# Altium schematic sheet driver2.SchDoc
size A4
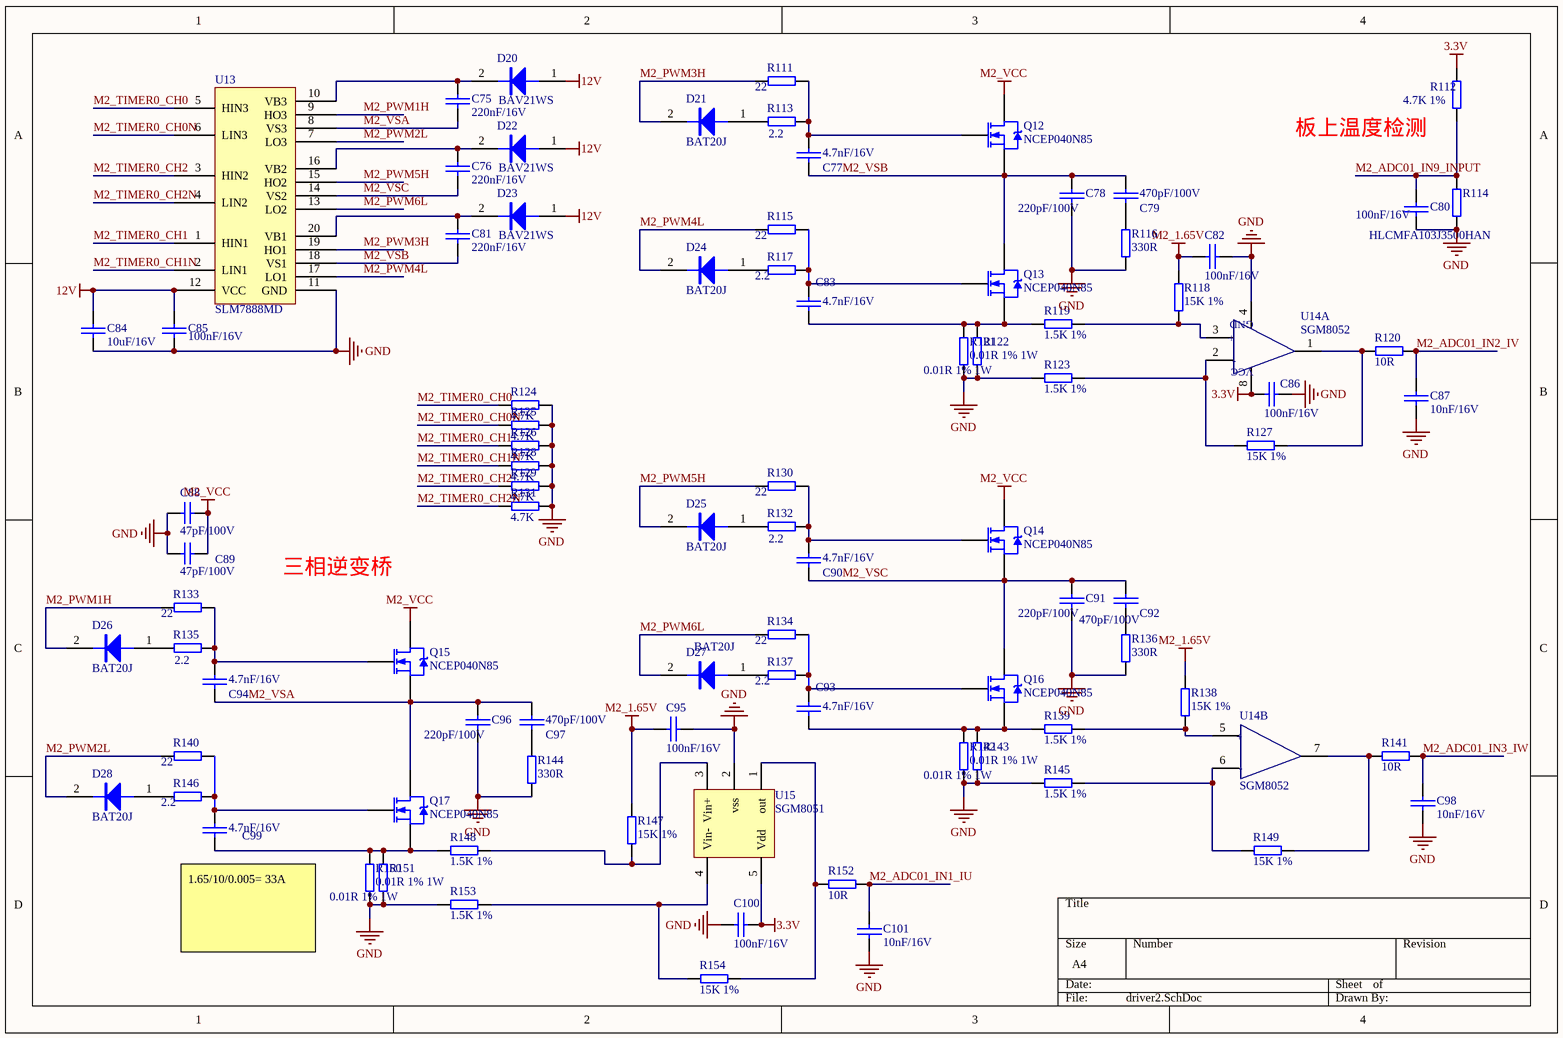
[diagram p0: driver2.SchDoc]

## Parts
C75  220nF/16V  [C0402]
C76  220nF/16V  [C0402]
C77  4.7nF/16V  [C0402]
C78  220pF/100V  [C0805]
C79  470pF/100V  [C0805]
C80  100nF/16V  [C0402]
C81  220nF/16V  [C0402]
C82  100nF/16V  [C0402]
C83  4.7nF/16V  [C0402]
C84  10uF/16V  [C0805]
C85  100nF/16V  [C0603]
C86  100nF/16V  [C0402]
C87  10nF/16V  [C0402]
C88  47pF/100V  [C1206]
C89  47pF/100V  [C1206]
C90  4.7nF/16V  [C0402]
C91  220pF/100V  [C0805]
C92  470pF/100V  [C0805]
C93  4.7nF/16V  [C0402]
C94  4.7nF/16V  [C0402]
C95  100nF/16V  [C0402]
C96  220pF/100V  [C0805]
C97  470pF/100V  [C0805]
C98  10nF/16V  [C0402]
C99  4.7nF/16V  [C0402]
C100  100nF/16V  [C0402]
C101  10nF/16V  [C0402]
D20  BAV21WS  [SOD-323]
D21  BAT20J  [SOD-323]
D22  BAV21WS  [SOD-323]
D23  BAV21WS  [SOD-323]
D24  BAT20J  [SOD-323]
D25  BAT20J  [SOD-323]
D26  BAT20J  [SOD-323]
D27  BAT20J  [SOD-323]
D28  BAT20J  [SOD-323]
Q12  NCEP040N85  [TO-220ABN]
Q13  NCEP040N85  [TO-220ABN]
Q14  NCEP040N85  [TO-220ABN]
Q15  NCEP040N85  [TO-220ABN]
Q16  NCEP040N85  [TO-220ABN]
Q17  NCEP040N85  [TO-220ABN]
R111  22  [R0603]
R112  4.7K 1%  [R0402]
R113  2.2  [R0603]
R114  HLCMFA103J3500HAN  [R0603]
R115  22  [R0603]
R116  330R  [R1206]
R117  2.2  [R0603]
R118  15K 1%  [R0402]
R119  1.5K 1%  [R0402]
R120  10R  [R0402]
R121  0.01R 1% 1W  [R1210]
R122  0.01R 1% 1W  [R1210]
R123  1.5K 1%  [R0402]
R124  4.7K  [R0402]
R125  4.7K  [R0402]
R126  4.7K  [R0402]
R127  15K 1%  [R0402]
R128  4.7K  [R0402]
R129  4.7K  [R0402]
R130  22  [R0603]
R131  4.7K  [R0402]
R132  2.2  [R0603]
R133  22  [R0603]
R134  22  [R0603]
R135  2.2  [R0603]
R136  330R  [R1206]
R137  2.2  [R0603]
R138  15K 1%  [R0402]
R139  1.5K 1%  [R0402]
R140  22  [R0603]
R141  10R  [R0402]
R142  0.01R 1% 1W  [R1210]
R143  0.01R 1% 1W  [R1210]
R144  330R  [R1206]
R145  1.5K 1%  [R0402]
R146  2.2  [R0603]
R147  15K 1%  [R0402]
R148  1.5K 1%  [R0402]
R149  15K 1%  [R0402]
R150  0.01R 1% 1W  [R1210]
R151  0.01R 1% 1W  [R1210]
R152  10R  [R0402]
R153  1.5K 1%  [R0402]
R154  15K 1%  [R0402]
U13  SLM7888MD  [TSSOP-20]
U14  SGM8052  [VSSOP/MSOP-8]  (parts A,B of 2)
U15  SGM8051  [SOT-23(5)]

## Nets
3.3V: C86.2 C100.2 R112.2 U14.8(VCC) U15.5(Vdd)
12V: C84.2 C85.2 D20.1(A) D22.1(A) D23.1(A) U13.12(VCC)
GND: C78.1 C80.2 C82.1 C84.1 C85.1 C86.1 C87.2 C88.2 C89.2 C91.1 C95.1 C96.1 C98.2 C100.1 C101.2 R114.1 R116.1 R121.2 R122.2 R123.2 R124.2 R125.2 R126.2 R128.2 R129.2 R131.2 R136.1 R142.2 R143.2 R144.1 R145.2 R150.2 R151.2 R153.2 U13.11(GND) U14.4(GND) U15.2(vss)
M2_1.65V: C82.2 C95.2 R118.1 R138.1 R147.1
M2_VCC: C88.1 C89.1 Q12.3(D) Q14.3(D) Q15.3(D)
M2_ADC01_IN1_IU: C101.1 R152.1
M2_ADC01_IN2_IV: C87.1 R120.1
M2_ADC01_IN3_IW: C98.1 R141.1
M2_ADC01_IN9_INPUT: C80.1 R112.1 R114.2
M2_PWM1H: D26.2(K) R133.2 U13.9(HO3)
M2_PWM2L: D28.2(K) R140.2 U13.7(LO3)
M2_PWM3H: D21.2(K) R111.2 U13.19(HO1)
M2_PWM4L: D24.2(K) R115.2 U13.17(LO1)
M2_PWM5H: D25.2(K) R130.2 U13.15(HO2)
M2_PWM6L: D27.2(K) R134.2 U13.13(LO2)
M2_TIMER0_CH0: R124.1 U13.5(HIN3)
M2_TIMER0_CH0N: R125.1 U13.6(LIN3)
M2_TIMER0_CH1: R126.1 U13.1(HIN1)
M2_TIMER0_CH1N: R128.1 U13.2(LIN1)
M2_TIMER0_CH2: R129.1 U13.3(HIN2)
M2_TIMER0_CH2N: R131.1 U13.4(LIN2)
M2_VSA: C75.1 C94.2 C96.2 C97.1 Q15.2(S) Q17.3(D) U13.8(VS3)
M2_VSB: C77.2 C78.2 C79.1 C81.1 Q12.2(S) Q13.3(D) U13.18(VS1)
M2_VSC: C76.1 C90.2 C91.2 C92.1 Q14.2(S) Q16.3(D) U13.14(VS2)
NetC75_2: C75.2 D20.2(K) U13.10(VB3)
NetC76_2: C76.2 D22.2(K) U13.16(VB2)
NetC77_1: C77.1 Q12.1(G) R111.1 R113.2
NetC79_2: C79.2 R116.2
NetC81_2: C81.2 D23.2(K) U13.20(VB1)
NetC83_1: C83.1 Q13.1(G) R115.1 R117.2
NetC83_2: C83.2 Q13.2(S) R119.2 R121.1 R122.1
NetC90_1: C90.1 Q14.1(G) R130.1 R132.2
NetC92_2: C92.2 R136.2
NetC93_1: C93.1 Q16.1(G) R134.1 R137.2
NetC93_2: C93.2 Q16.2(S) R139.2 R142.1 R143.1
NetC94_1: C94.1 Q15.1(G) R133.1 R135.2
NetC97_2: C97.2 R144.2
NetC99_1: C99.1 Q17.1(G) R140.1 R146.2
NetC99_2: C99.2 Q17.2(S) R148.2 R150.1 R151.1
NetD21_1: D21.1(A) R113.1
NetD24_1: D24.1(A) R117.1
NetD25_1: D25.1(A) R132.1
NetD26_1: D26.1(A) R135.1
NetD27_1: D27.1(A) R137.1
NetD28_1: D28.1(A) R146.1
NetR118_2: R118.2 R119.1 U14.3(-)
NetR120_2: R120.2 R127.1 U14.1(OUT1)
NetR123_1: R123.1 R127.2 U14.2(-)
NetR138_2: R138.2 R139.1 U14.5(+)
NetR141_2: R141.2 R149.1 U14.7(OUT2)
NetR145_1: R145.1 R149.2 U14.6(-)
NetR147_2: R147.2 R148.1 U15.3(Vin+)
NetR152_2: R152.2 R154.1 U15.1(out)
NetR153_1: R153.1 R154.2 U15.4(Vin-)

## Notes on the sheet
- 板上温度检测
- 三相逆变桥
- (near C99) 1.65/10/0.005= 33A

## Library data of the parts
C75-C87 C90-C101 = CAP: Capacitor
C88 C89 = cap
D20-D28 = DIODE
Q12-Q17 = N-channel Enhancement MOS
R111-R115 R117 R124-R126 R128-R135 R137 R140 R146 = R
R116 R118-R123 R127 R136 R138 R139 R141-R145 R147-R154 = Resistance
U13 = SLM7888: SILLUMIN
U14 = LM393: 圣邦微电子
U15 = LMV7239: 圣邦微电子